# Altium schematic sheet FPGA Config.SchDoc
size A4
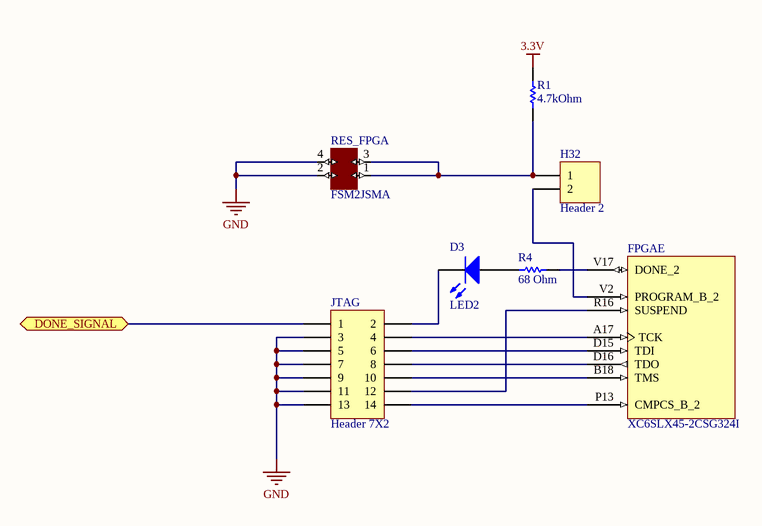
[diagram p0: FPGA Config.SchDoc]

## Parts
D3  LED2  [3.2X1.6X1.1]
FPGA  XC6SLX45-2CSG324I  [CSG324]  (part E of 8)
H32  Header 2  [HDR1X2]
JTAG  Header 7X2  [HDR2X7]
R1  4.7kOhm  [RESC0603(1608)_M]
R4  68 Ohm  [RESC0603(1608)_M]
RES_FPGA  FSM2JSMA  [Button]

## Ports
DONE_SIGNAL

## Nets
3.3V: R1.2
GND: JTAG.3 JTAG.5 JTAG.7 JTAG.9 JTAG.11 JTAG.13 RES_FPGA.2 RES_FPGA.4
DONE_SIGNAL: JTAG.1 ; port DONE_SIGNAL
NetD3_1: D3.1(A) R4.1
NetD3_2: D3.2(K) JTAG.2
NetFPGA_A17: FPGA.A17(TCK) JTAG.4
NetFPGA_B18: FPGA.B18(TMS) JTAG.10
NetFPGA_D15: FPGA.D15(TDI) JTAG.6
NetFPGA_D16: FPGA.D16(TDO) JTAG.8
NetFPGA_P13: FPGA.P13(CMPCS_B_2) JTAG.14
NetFPGA_R16: FPGA.R16(SUSPEND) JTAG.12
NetFPGA_V2: FPGA.V2(PROGRAM_B_2) H32.2
NetFPGA_V17: FPGA.V17(DONE_2) R4.2
NetH32_1: H32.1 R1.1 RES_FPGA.1 RES_FPGA.3

## Library data of the parts
D3 = LED2: Typical RED, GREEN, YELLOW, AMBER GaAs LED; Published: 8-Jun-2000; LatestRevisionDate: 17-Jul-2002; LatestRevisionNote: Re-released for DXP Platform.; PackageVersion: Feb-2002; PackageReference: 3.2X1.6X1.1; Publisher: Altium Limited; PackageDescription: SM LED; 2 Flat Leads
FPGA = XC6SLX45-2CSG324I: Spartan-6 LX 1.2V FPGA, 218 User I/Os, 324-Ball Chip-Scale BGA (0.8mm Pitch), Speed Grade 2, Industrial Grade, Pb-Free; Published: 17-Nov-2009; DatasheetVersion: ver1.6, Nov-2010; PackageVersion: ver1.1, Nov-2009; PackageReference: CSG324; Publisher: Altium Limited; PackageDescription: 324-Ball Chip-Scale BGA (CSG324) Package, 0.8 mm Pitch; Supplier 1: Digi-Key; Supplier Part Number 1: XC6SLX45-2CSG324I-ND; Code_JEDEC: MO-275-KKAC-1; ComponentLink1Description: Manufacturer Link; ComponentLink1URL: http://www.xilinx.com; ComponentLink2Description: Spartan-6 Datasheet; ComponentLink2URL: http://www.xilinx.com/support/documentation/data_sheets/ds160.pdf; ComponentLink3Description: Spartan-6 Documents; ComponentLink3URL: http://www.xilinx.com/support/documentation/spartan-6.htm; ComponentLink4Description: Xilinx.com Home; ComponentLink4URL: http://www.xilinx.com
H32 = Header 2: Header, 2-Pin; LatestRevisionDate: 17-Jul-2002; LatestRevisionNote: Re-released for DXP Platform.; Publisher: Altium Limited
JTAG = Header 7X2: Header, 7-Pin, Dual row; LatestRevisionDate: 17-Jul-2002; LatestRevisionNote: Re-released for DXP Platform.; Publisher: Altium Limited
R1 R4 = CMP-1012-00002-1: 1R 0.1W 5% 0603 (1608 Metric)  SMD; Case-Metric: 1608; Case-EIA: 0603; Power: 0.1 W; Technology: SMT; Tolerance: 5 %
  R1: Value: 4.7kOhm
  R4: Value: 68 Ohm
RES_FPGA = switch-button